# Altium schematic sheet altium schematic.SchDoc
size A4; SheetNumber: 1; SheetTotal: 1
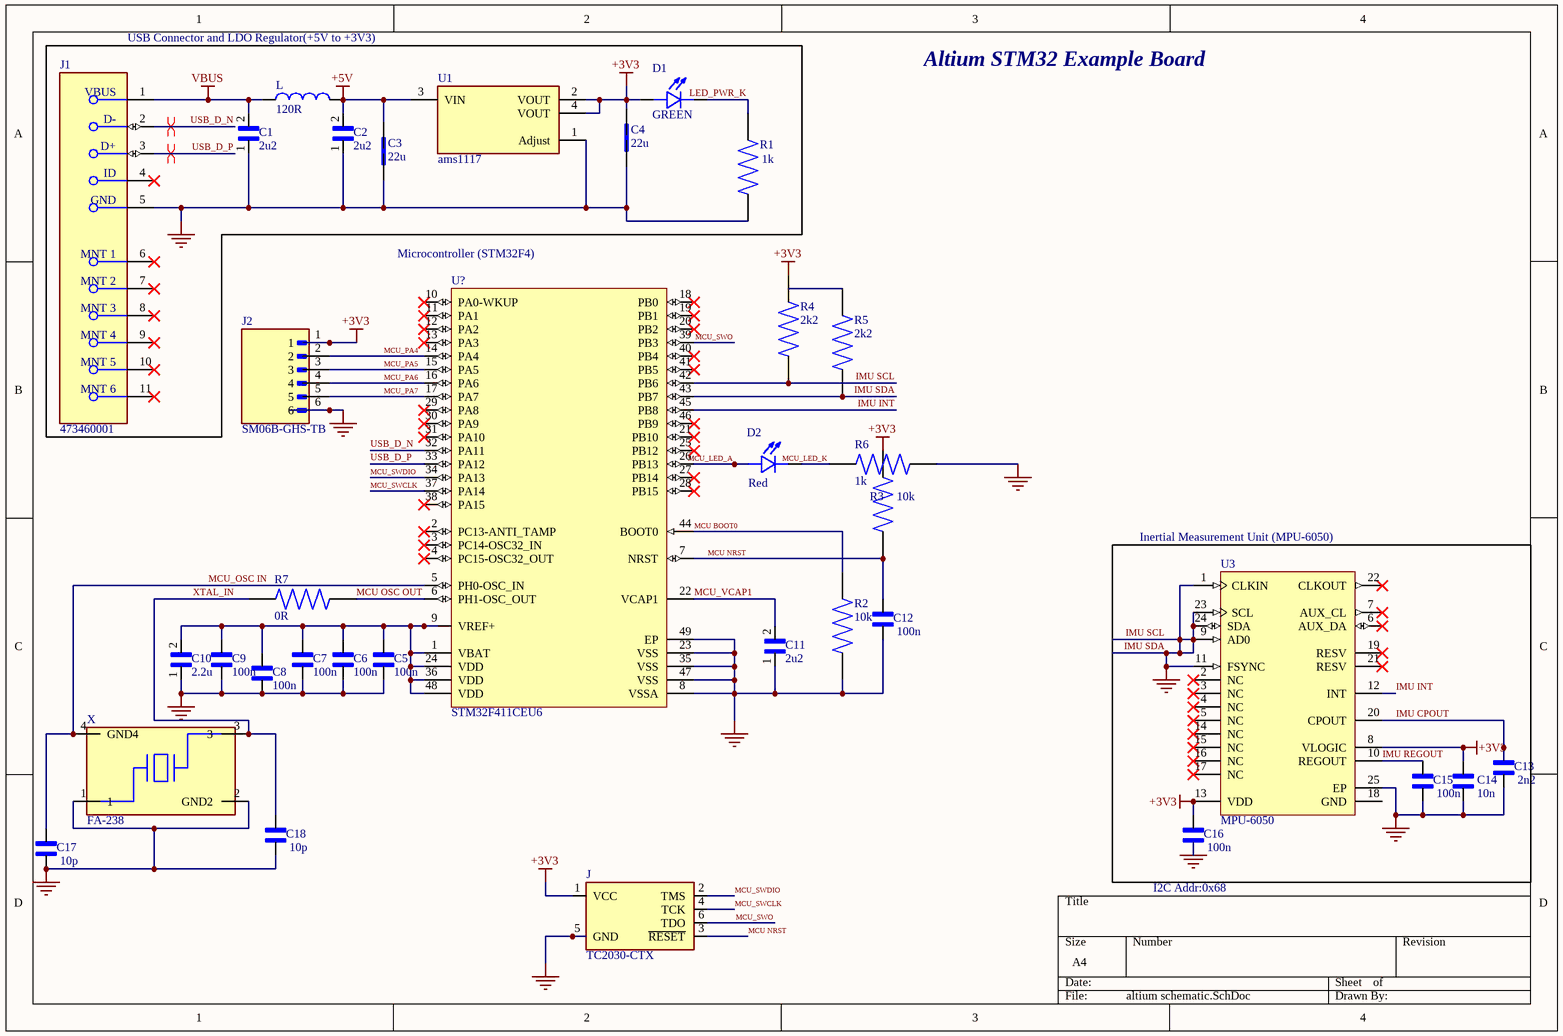
[diagram p0: altium schematic.SchDoc]

## Parts
C1  2u2  [CAPC1608X90N]
C2  2u2  [CAPC1608X90N]
C3  22u  [CAPC2012X70]
C4  22u  [CAPC2012X70]
C5  100n  [CAPC1005X55N]
C6  100n  [CAPC1005X55N]
C7  100n  [CAPC1005X55N]
C8  100n  [CAPC1005X55N]
C9  100n  [CAPC1005X55N]
C10  2.2u  [CAPC1608X90N]
C11  2u2  [CAPC1608X90N]
C12  100n  [CAPC1005X55N]
C13  2n2  [CAPC1005X55N]
C14  10n  [CAPC1005X55N]
C15  100n  [CAPC1005X55N]
C16  100n  [CAPC1005X55N]
C17  10p  [CAPC1005X55N]
C18  10p  [CAPC1005X55N]
D1  GREEN  [LED_APHHS1005LCGCK]
D2  Red  [LED_APHHS1005LSECK/J3-PF]
J  TC2030-CTX  [TC2030-IDC-NL]
J1  473460001  [FP-473460001-MFG]
J2  SM06B-GHS-TB  [JST_SM06B-GHS-TB]
L  120R  [WE-CBF_0603_W2.2]
R1  1k  [RES_ERJU02F5101X]
R2  10k  [RES_ERJU02F5101X]
R3  10k  [RES_ERJU02F5101X]
R4  2k2  [RES_ERJU02F5101X]
R5  2k2  [RES_ERJU02F5101X]
R6  1k  [RES_ERJU02F5101X]
R7  0R  [RES_ERJU02F5101X]
U1  ams1117  [FP-ams1117-IPC_C]
U3  MPU-6050  [IS-QFN-24_V]
U?  STM32F411CEU6  [STM-UFQFPN48_L]
X  FA-238  [OSCCC320X250X70-4N]

## Blocks framed on the sheet
USB Connector and LDO Regulator(+5V to +3V3): C1-C4 D1 J1 L R1 U1
Inertial Measurement Unit (MPU-6050): C13-C16 U3

## Nets
+3V3: C4.1 C14.1 C16.1 D1.2(A) J.1(VCC) J2.1 R3.2 R4.2 U1.2(VOUT) U1.4(VOUT) U3.8(VLOGIC) U3.13(VDD)
+5V: C2.2 C3.1 L.2 U1.3(VIN)
IMU SCL: C1.1 C2.1 C3.2 C4.2 C5.2 C6.2 C7.2 C8.2 C9.2 C10.1 C11.1 C12.2 C13.2 C14.2 C15.2 C16.2 C17.2 C18.2 J.5(GND) J1.5(GND) J2.6 R1.1 R2.2 R4.1 R5.1 R6.2 U1.1(Adjust) U3.1(CLKIN) U3.9(AD0) U3.11(FSYNC) U3.23(SCL) U3.24(SDA) U3.25(EP) U?.8(VSSA) U?.23(VSS) U?.35(VSS) U?.42(PB6) U?.43(PB7) U?.47(VSS) U?.49(EP) X.1 X.2(GND2)  [also labelled GND, IMU SDA]
VBUS: C1.2 J1.1(VBUS) L.1
IMU CPOUT: C13.1 U3.20(CPOUT)
IMU INT: U3.12(INT) U?.45(PB8)
IMU REGOUT: C15.1 U3.10(REGOUT)
LED_PWR_K: D1.1(C) R1.2
MCU BOOT0: R2.1 U?.44(BOOT0)
MCU NRST: C12.1 J.3(~{RESET}) R3.1 U?.7(NRST)
MCU OSC OUT: R7.1 U?.6(PH1-OSC_OUT)
MCU_LED_A: D2.2(A) U?.26(PB13)
MCU_LED_K: D2.1(C) R6.1
MCU_OSC IN: C17.1 U?.5(PH0-OSC_IN) X.4(GND4)
MCU_PA4: J2.2 U?.14(PA4)
MCU_PA5: J2.3 U?.15(PA5)
MCU_PA6: J2.4 U?.16(PA6)
MCU_PA7: J2.5 U?.17(PA7)
MCU_SWCLK: J.4(TCK) U?.37(PA14)
MCU_SWDIO: J.2(TMS) U?.34(PA13)
MCU_SWO: J.6(TDO) U?.39(PB3)
MCU_VCAP1: C11.2 U?.22(VCAP1)
USB_D_N: J1.2(D-) U?.32(PA11)
USB_D_P: J1.3(D+) U?.33(PA12)
XTAL_IN: C18.1 R7.2 X.3
NetC5_1: C5.1 C6.1 C7.1 C8.1 C9.1 C10.2 U?.1(VBAT) U?.9(VREF+) U?.24(VDD) U?.36(VDD) U?.48(VDD)

Not connected (* = marked no-connect by the designer): J1 4(ID)* 6(MNT_1)* 7(MNT_2)* 8(MNT_3)* 9(MNT_4)* 10(MNT_5)* 11(MNT_6)*; R5 2; U3 2(NC)* 3(NC)* 4(NC)* 5(NC)* 6(AUX_DA)* 7(AUX_CL)* 14(NC)* 15(NC)* 16(NC)* 17(NC)* 18(GND) 19(RESV)* 21(RESV)* 22(CLKOUT)*; U? 2(PC13-ANTI_TAMP)* 3(PC14-OSC32_IN)* 4(PC15-OSC32_OUT)* 10(PA0-WKUP)* 11(PA1)* 12(PA2)* 13(PA3)* 18(PB0)* 19(PB1)* 20(PB2)* 21(PB10)* 25(PB12)* 27(PB14)* 28(PB15)* 29(PA8)* 30(PA9)* 31(PA10)* 38(PA15)* 40(PB4)* 41(PB5)* 46(PB9)*

## Layout directives
differential pair; differential pair class DIFF USB: USB_D_N, USB_D_P

## Notes on the sheet
- Altium STM32 Example Board
- (near U?) Microcontroller (STM32F4)
- (near C16) I2C Addr:0x68

## Library data of the parts
C1 C2 C10 C11 = C0603C225K4PACTU: 2.2ÂµF Â±10% 16V Ceramic Capacitor X5R 0603 _1608 Metric_; MF: KEMET; SnapEDA_Link: https://www.snapeda.com/parts/C0603C225K4PACTU/KEMET/view-part/609526/?ref=snap; Value: *; Availability: Unavailable; Price: None; MP: C0603C225K4PACTU; Package: 0603 KEMET
C3 C4 = CC0805KFX7R7BB105: 1ÂµF Â±10% 16V Ceramic Capacitor X7R 0805 (2012 Metric); MF: Yageo; Value: *; Price: None; Package: 0805 Yageo; Check_prices: https://www.snapeda.com/parts/CC0805KFX7R7BB105/Yageo/view-part/1818153/?ref=eda; SnapEDA_Link: https://www.snapeda.com/parts/CC0805KFX7R7BB105/Yageo/view-part/1818153/?ref=snap; Availability: Warning; Purchase-URL: https://pricing.snapeda.com/search/part/CC0805KFX7R7BB105/?ref=eda; MP: CC0805KFX7R7BB105
C5-C9 C12-C18 = CC0402JRX7R7BB104: 0.1 ÂµF Â±5% 16V Ceramic Capacitor X7R 0402 (1005 Metric); MF: Yageo; SnapEDA_Link: https://www.snapeda.com/parts/CC0402JRX7R7BB104/Yageo/view-part/?ref=snap; Package: 0402 Yageo; Value: *; MP: CC0402JRX7R7BB104; Check_prices: https://www.snapeda.com/parts/CC0402JRX7R7BB104/Yageo/view-part/?ref=eda
D1 = APHHS1005LCGCK: Green 570nm LED Indication - Discrete 1.9V 0402 (1005 Metric); MF: Kingbright; SnapEDA_Link: https://www.snapeda.com/parts/APHHS1005LCGCK/Kingbright/view-part/?ref=snap; Package: 0402 Kingbright Corporation; Value: *; MP: APHHS1005LCGCK; Check_prices: https://www.snapeda.com/parts/APHHS1005LCGCK/Kingbright/view-part/?ref=eda
D2 = APHHS1005LSECK/J3-PF: Red 625nm LED Indication - Discrete 1.8V 0402 (1005 Metric); MF: Kingbright; SnapEDA_Link: https://www.snapeda.com/parts/APHHS1005LSECK/J3-PF/Kingbright/view-part/?ref=snap; Package: 0402 Kingbright Corporation; Value: *; MP: APHHS1005LSECK/J3-PF; Check_prices: https://www.snapeda.com/parts/APHHS1005LSECK/J3-PF/Kingbright/view-part/?ref=eda
J = TC2030-CTX: CortexÂ® Plug-Of-Nailsâ„¢ Adapter Cable; MF: Tag-Connect LLC; Availability: Unavailable; Package: None; MP: TC2030-CTX; SnapEDA_Link: https://www.snapeda.com/parts/TC2030-CTX/Tag-Connect%20LLC/view-part/225831/?ref=snap; Value: *; Price: None
J1 = CMP-2000-05246-2: CONN RCPT USB2.0 MICRO B SMD R/A; Manufacturer: Molex; Conn Orientation: Right Angle; Is Female: yes; Shielding: true; Pitch: 0.65mm; Number Of Contacts: 5; Description: USB - micro B USB 2.0 Receptacle Connector 5 Position Surface Mount, Right Angle; Voltage Rating: 30V; Current Rating: 1.8A; Device Class L2: USB Connectors; Digikey Description: CONN RCPT USB2.0 MICRO B SMD R/A; Height: 2.945mm; RoHS: TRUE; ComponentLink2Description: Datasheet; Octopart: https://octopart.com/47346-0001-molex-7164928; Automotive: No; Package: 0; Category: Conn; Device Class L1: Connectors; Usb Standard: USB 2.0; Temperature: -30°C to +85°C; Temperature Range Low: -30°C; Footprint Url: https://www.molex.com/pdm_docs/sd/473460001_sd.pdf; ComponentLink2URL: https://www.molex.com/webdocs/datasheets/pdf/en-us/0473460001_IO_CONNECTORS.pdf; Lead Free: Yes; Manufacturer Part Number: 473460001; Contact Material: Gold,Nickel; Temperature Range High: +85°C; Device Class L3: unset
J2 = SM06B-GHS-TB: Connector Header Surface Mount, Right Angle 6 position 0.049 (1.25mm); MF: JST Sales; SnapEDA_Link: https://www.snapeda.com/parts/SM06B-GHS-TB/JST/view-part/?ref=snap; Package: None; Value: *; MP: SM06B-GHS-TB; Check_prices: https://www.snapeda.com/parts/SM06B-GHS-TB/JST/view-part/?ref=eda
L = WE-CBF_0603: FERRITE BEAD 600 OHM 0603 1LN; MF: WÃ¼rth Elektronik; MP: 74279265; SnapEDA_Link: https://www.snapeda.com/parts/74279265/W%25C3%25BCrth+Elektronik+Midcom/view-part/?ref=snap; Package: 0603 Wurth Elektronik; Value: *; Check_prices: https://www.snapeda.com/parts/74279265/W%25C3%25BCrth+Elektronik+Midcom/view-part/?ref=eda
R1-R7 = ERJU02F5101X: Package: None; MP: ERJU02F5101X; Price: None; Availability: Unavailable; Value: *
U1 = CMP-209535-000002-1: 1A LOW DROPOUT VOLTAGE REGULATOR; RoHS Compliant: Yes
U3 = CMP-1753-00002-2: 3-Axis Gyroscope, Accelerometer and a Digital Motion Processor(TM) (DMP), 2.375 to 3.46 V, -40 to 85 degC, 24-Pin QFN, RoHS, Tape and Reel; Manufacturer: InvenSense; Featured Product: MPU-60506-Axis,IntegratedI²CSolution; Other Names: 1428-1007-2 / MPU6050; Sensor Type: MotionTracking; Online Catalog: MPU-6000™Series; Unit PriceUSD: Digital; Datasheet Version: Rev. 3.3, 05/2012; Category: Sensors,Transducers; Datasheet URL: http://datasheet.octopart.com/MPU-6050-InvenSense-datasheet-14421344.pdf; Family: Multifunction; Standard Package: 5,000; Manufacturer URL: http://www.invensense.com/; Output Type: Digital; Dynamic Catalog: MPU-6000™Series
U? = CMP-0243-00165-1: ARM Cortex-M4 32-bit MCU+FPU, 512 KB Flash, 128 KB RAM, 36 I/Os, 48-Pin UFQFPN, -40 to 85 degC, Tray; Operating Frequency(F) (Processor speed) (MHz): 100; FLASH Size (Prog) (kB): 512; Internal RAM Size (kB): 128; I/Os (High Current): 36; Supply Voltage(Vcc) min (V): 1.7; Package Reference: 48-Pin Ultra Thin Fine Pitch Quad Flat No-Lead, 7 x 7 x 0.6 mm Body, 0.5 mm Pitch, Exposed Pad; ComponentLink1Description: Manufacturer URL; ComponentLink1URL: http://www.st.com/; Packing: Tray; Package Description: UFQFPN48; Core: ARM Cortex-M4; ComponentLink2Description: Datasheet; ComponentLink2URL: http://www.st.com/st-web-ui/static/active/en/resource/technical/document/datasheet/DM00115249.pdf; DatasheetVersion: Rev. 6; Mounting Technology: Surface Mount
X = FA-238: 19.968MHz Â±20ppm Crystal 7pF 80 Ohms 4-SMD, No Lead; MF: EPSON; Value: *; SnapEDA_Link: https://www.snapeda.com/parts/FA-238/EPSON/view-part/562897/?ref=snap; Price: None; Availability: Unavailable; Package: SMD-4 EPSON; MP: FA-238